# Altium schematic sheet Sheet1.SchDoc
size A; SheetNumber: 1; SheetTotal: 1
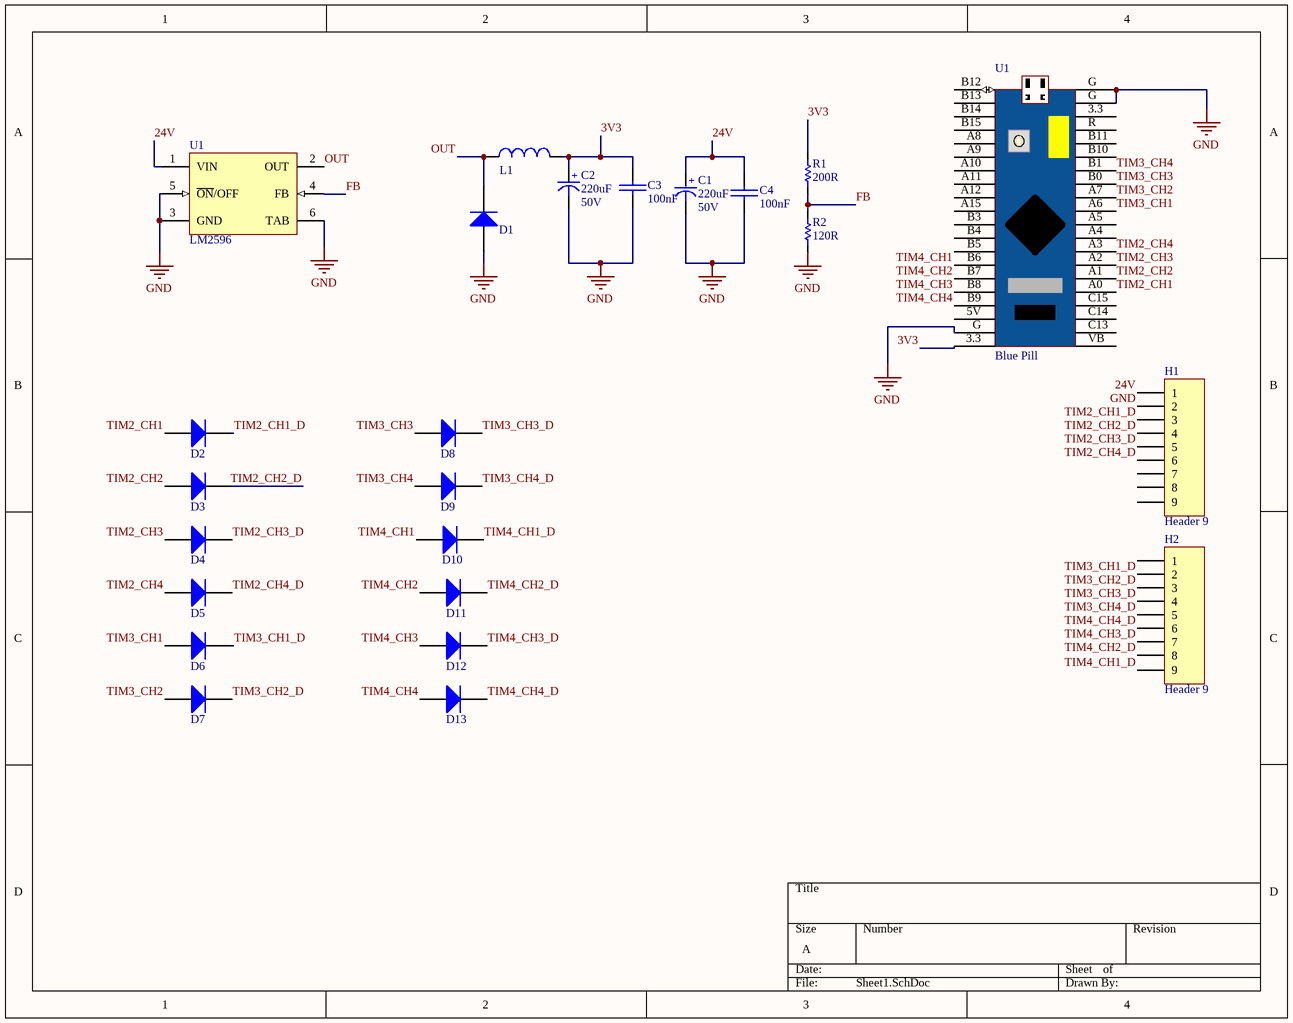
[diagram p0: Sheet1.SchDoc]

## Parts
(Parts that share a designator on the sheet are numbered #1, #2 ... from top to bottom, then left to right.)
C1  Voltage: 50V  [Cap_Al_9.3MM]  (hidden comment: 220uF)
C2  Voltage: 50V  [Cap_Al_9.3MM]  (hidden comment: 220uF)
C3  100nF  [SMD_CAP_1206]
C4  100nF  [SMD_CAP_1206]
D1  D?  [LL4148]  (value not drawn)
D2  D?  [LL4148]  (value not drawn)
D3  D?  [LL4148]  (value not drawn)
D4  D?  [LL4148]  (value not drawn)
D5  D?  [LL4148]  (value not drawn)
D6  D?  [LL4148]  (value not drawn)
D7  D?  [LL4148]  (value not drawn)
D8  D?  [LL4148]  (value not drawn)
D9  D?  [LL4148]  (value not drawn)
D10  D?  [LL4148]  (value not drawn)
D11  D?  [LL4148]  (value not drawn)
D12  D?  [LL4148]  (value not drawn)
D13  D?  [LL4148]  (value not drawn)
H1  Header 9  [1X09]
H2  Header 9  [1X09]
L1  Inductor  [induc-smd]  (value not drawn)
R1  200R  [SMD RES 1206]
R2  120R  [SMD RES 1206]
U1#1  LM2596  [LM2596 12V SMD]
U1#2  Blue Pill  [Blue Pill]

## Nets
GND: C1.2(-) C2.2(-) C3.2(-) C4.2(-) D1.1(A) H1.2 R2.1 U1#1.3(GND) U1#1.5(~{ON}/OFF) U1#1.6(TAB) U1#2.G
3V3: C2.1(+) C3.1(+) L1.2 R1.2 U1#2.3.3
24V: C1.1(+) C4.1(+) H1.1 U1#1.1(VIN)
FB: R1.1 R2.2 U1#1.4(FB)
OUT: D1.2(K) L1.1 U1#1.2(OUT)
TIM2_CH1: D2.1(A) U1#2.A0
TIM2_CH1_D: D2.2(K) H1.3
TIM2_CH2: D3.1(A) U1#2.A1
TIM2_CH2_D: D3.2(K) H1.4
TIM2_CH3: D4.1(A) U1#2.A2
TIM2_CH3_D: D4.2(K) H1.5
TIM2_CH4: D5.1(A) U1#2.A3
TIM2_CH4_D: D5.2(K) H1.6
TIM3_CH1: D6.1(A) U1#2.A6
TIM3_CH1_D: D6.2(K) H2.2
TIM3_CH2: D7.1(A) U1#2.A7
TIM3_CH2_D: D7.2(K) H2.3
TIM3_CH3: D8.1(A) U1#2.B0
TIM3_CH3_D: D8.2(K) H2.4
TIM3_CH4: D9.1(A) U1#2.B1
TIM3_CH4_D: D9.2(K) H2.5
TIM4_CH1: D10.1(A) U1#2.B6
TIM4_CH1_D: D10.2(K) H2.9
TIM4_CH2: D11.1(A) U1#2.B7
TIM4_CH2_D: D11.2(K) H2.8
TIM4_CH3: D12.1(A) U1#2.B8
TIM4_CH3_D: D12.2(K) H2.7
TIM4_CH4: D13.1(A) U1#2.B9
TIM4_CH4_D: D13.2(K) H2.6

Not connected (* = marked no-connect by the designer): H1 7 8 9; H2 1; U1#2 5V(18) A4(29) A5(30) A8 A9 A10(7) A11(8) A12(9) A15(10) B3(11) B4(12) B5(13) B10(35) B11(36) B12 B13 B14 B15 C13(22) C14(23) C15(24) R(37) VB(21)

## Library data of the parts
C1 C2 = Cap-Polar: Polar Capacitor; Designer: Saeid Jorablo; Organazation: ControTec; Adding Date: 1387/12/20; Value: 220uF
C3 C4 = Cap-Bipolar: Bipolar Capacitor; Voltage: 100V; Designer: Saeid Jorablo; Organazation: ControTec; Adding Date: 1387/12/20; Value: 100nF
D1-D13 = Diode
R1 R2 = Resistor: Published: 8-Jun-2000; LatestRevisionDate: 17-Jul-2002; LatestRevisionNote: Re-released for DXP Platform.; PackageReference: AXIAL-0.3; Publisher: Altium Limited; PackageDescription: Axial Device, Thru-Hole; 2 Leads; 0.3 in Pin Spacing
  R1: value: 200R
  R2: value: 120R